# Altium schematic sheet 角度采集板.SchDoc
size A4
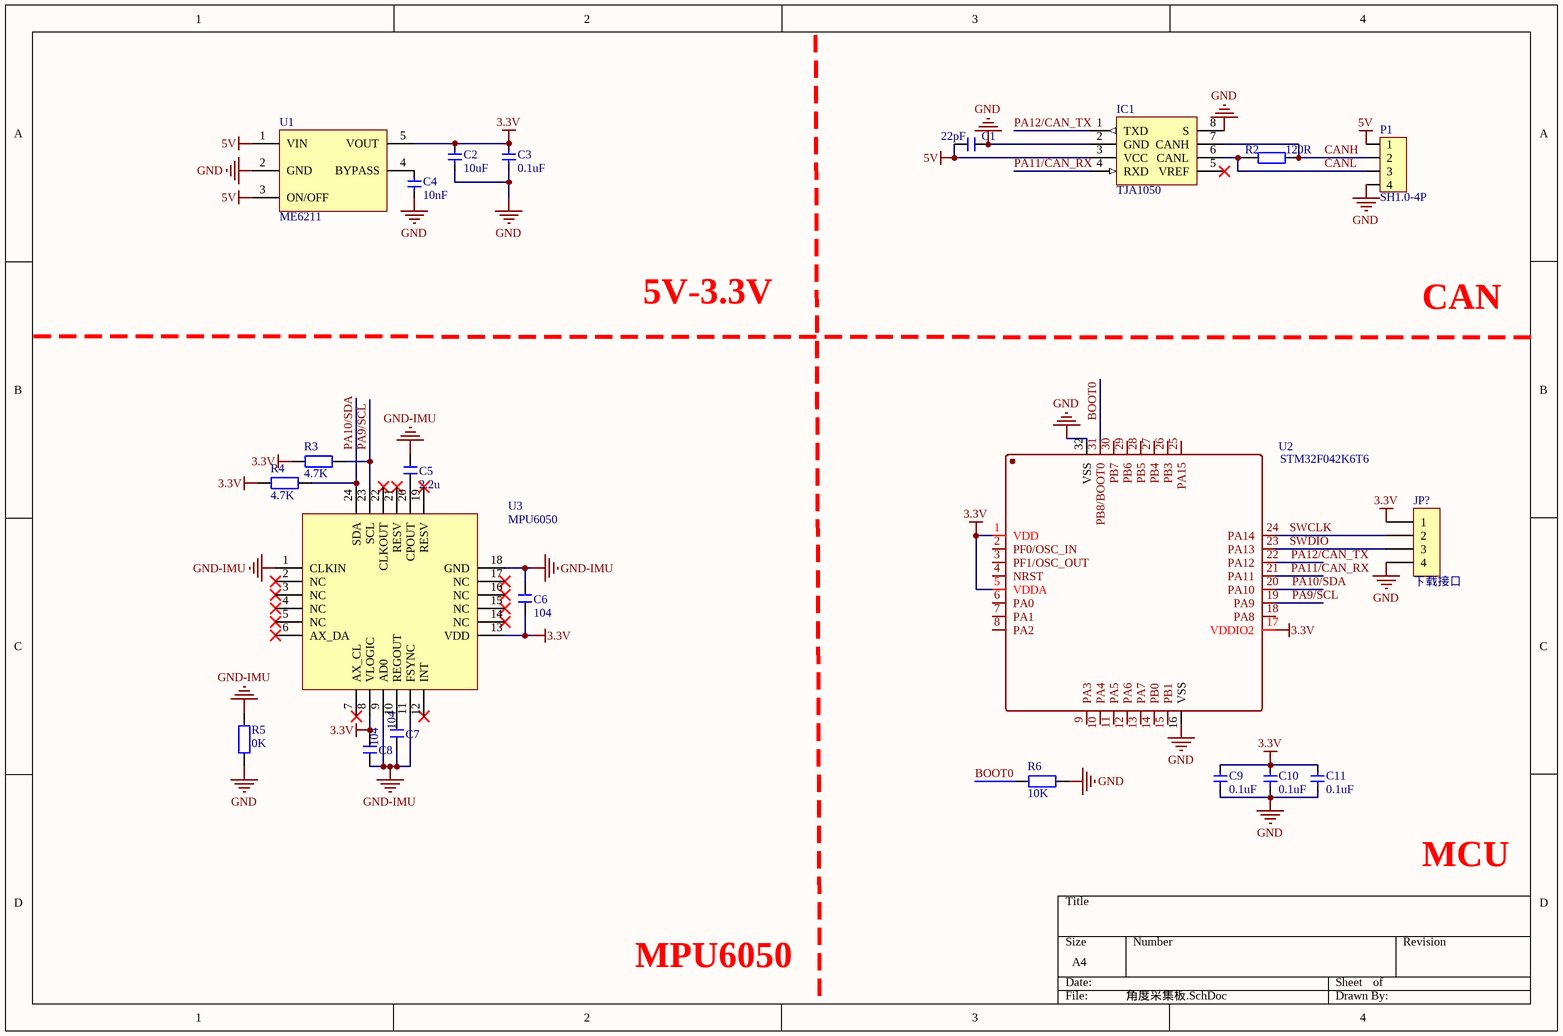
[diagram p0: 角度采集板.SchDoc]

## Parts
C1  22pF  [C 0402_L]
C2  10uF  [C 0402_L]
C3  0.1uF  [C 0402_L]
C4  10nF  [C 0402_L]
C5  2.2u  [C 0402_L]
C6  104  [C 0402_L]
C7  104  [C 0402_L]
C8  104  [C 0402_L]
C9  0.1uF  [C 0402_L]
C10  0.1uF  [C 0402_L]
C11  0.1uF  [C 0402_L]
IC1  TJA1050  [SOP8_L]
JP?  下载接口  [下载接口]
P1  SH1.0-4P  [SH1.0-4P]
R2  120R  [R 0402_L]
R3  4.7K  [R 0402_L]
R4  4.7K  [R 0402_L]
R5  0K  [R 0402_L]
R6  10K  [R 0402_L]
U1  ME6211  [SOT23-5]
U2  STM32F042K6T6  [LQFP32-7*7]
U3  MPU6050  [QFN24 4x4_L]

## Nets
3.3V: C2.2 C3.2 C6.1 C8.2 C9.2 C10.2 C11.2 JP?.1 R3.1 R4.1 U1.5(VOUT) U2.1(VDD) U2.5(VDDA) U2.17(VDDIO2) U3.8(VLOGIC) U3.13(VDD)
5V: C1.2 IC1.3(VCC) P1.1 U1.1(VIN) U1.3(ON/OFF)
GND: C1.1 C2.1 C3.1 C4.1 C9.1 C10.1 C11.1 IC1.2(GND) IC1.8(S) JP?.4 P1.4 R5.1 R6.2 U1.2(GND) U2.16(VSS) U2.32(VSS)
GND-IMU: C5.1 C6.2 C7.1 C8.1 R5.2 U3.1(CLKIN) U3.9(AD0) U3.11(FSYNC) U3.18(GND)
BOOT0: R6.1 U2.31(PB8/BOOT0)
CANH: IC1.7(CANH) P1.2 R2.1
CANL: IC1.6(CANL) P1.3 R2.2
PA9/SCL: R3.2 U2.19(PA9) U3.23(SCL)
PA10/SDA: R4.2 U2.20(PA10) U3.24(SDA)
PA11/CAN_RX: IC1.4(RXD) U2.21(PA11)
PA12/CAN_TX: IC1.1(TXD) U2.22(PA12)
SWCLK: JP?.2 U2.24(PA14)
SWDIO: JP?.3 U2.23(PA13)
NetC4_2: C4.2 U1.4(BYPASS)
NetC5_2: C5.2 U3.20(CPOUT)
NetC7_2: C7.2 U3.10(REGOUT)

Not connected (* = marked no-connect by the designer): IC1 5(VREF)*; U2 2(PF0/OSC_IN) 3(PF1/OSC_OUT) 4(NRST) 6(PA0) 7(PA1) 8(PA2) 9(PA3) 10(PA4) 11(PA5) 12(PA6) 13(PA7) 14(PB0) 15(PB1) 18(PA8) 25(PA15) 26(PB3) 27(PB4) 28(PB5) 29(PB6) 30(PB7); U3 2(NC)* 3(NC)* 4(NC)* 5(NC)* 6(AX_DA)* 7(AX_CL)* 12(INT)* 14(NC)* 15(NC)* 16(NC)* 17(NC)* 19(RESV)* 21(RESV)* 22(CLKOUT)*

## Notes on the sheet
- 5V-3.3V
- CAN
- MCU
- MPU6050

## Library data of the parts
C1 C5-C8 = C: 贴片电容; BOM名称: 无极性贴片电容; 淘宝ID: 封装库来自淘宝 ID：黄晶宝石; 联系售后，技术支持: https://shop463601444.taobao.com; 唯一出售店铺网址: https://shop463601444.taobao.com
C2-C4 C9-C11 = 电容-0402: Capacitor; Value: 0.1u
IC1 = TJA1050: CAN总线收发芯片; 版权归属: 封装库来自淘宝 ID：黄晶宝石; BOM名称: CAN总线收发芯片; 学习资源: https://shop463601444.taobao.com
JP? = 下载接口: Jlink下载接口
R2-R6 = R: 贴片电阻; 版权归属: 来自淘宝 ID：黄晶宝石; 封装库来自淘宝卖家 ID：黄晶宝石: 其他店铺购入均为盗版，不享受售后技术支持服务，请立即申请退款; BOM名称: 贴片电阻; 联系售后: https://shop463601444.taobao.com
U1 = ME6211: DC降压芯片
U3 = MPU6050: 数字运动传感器; 版权归属: 源创客; BOM名称: 数字运动传感器; 学习资源: www.ooocke.com